# EAGLE schematic DeadHorsePCB (EAGLE 8.3.1)
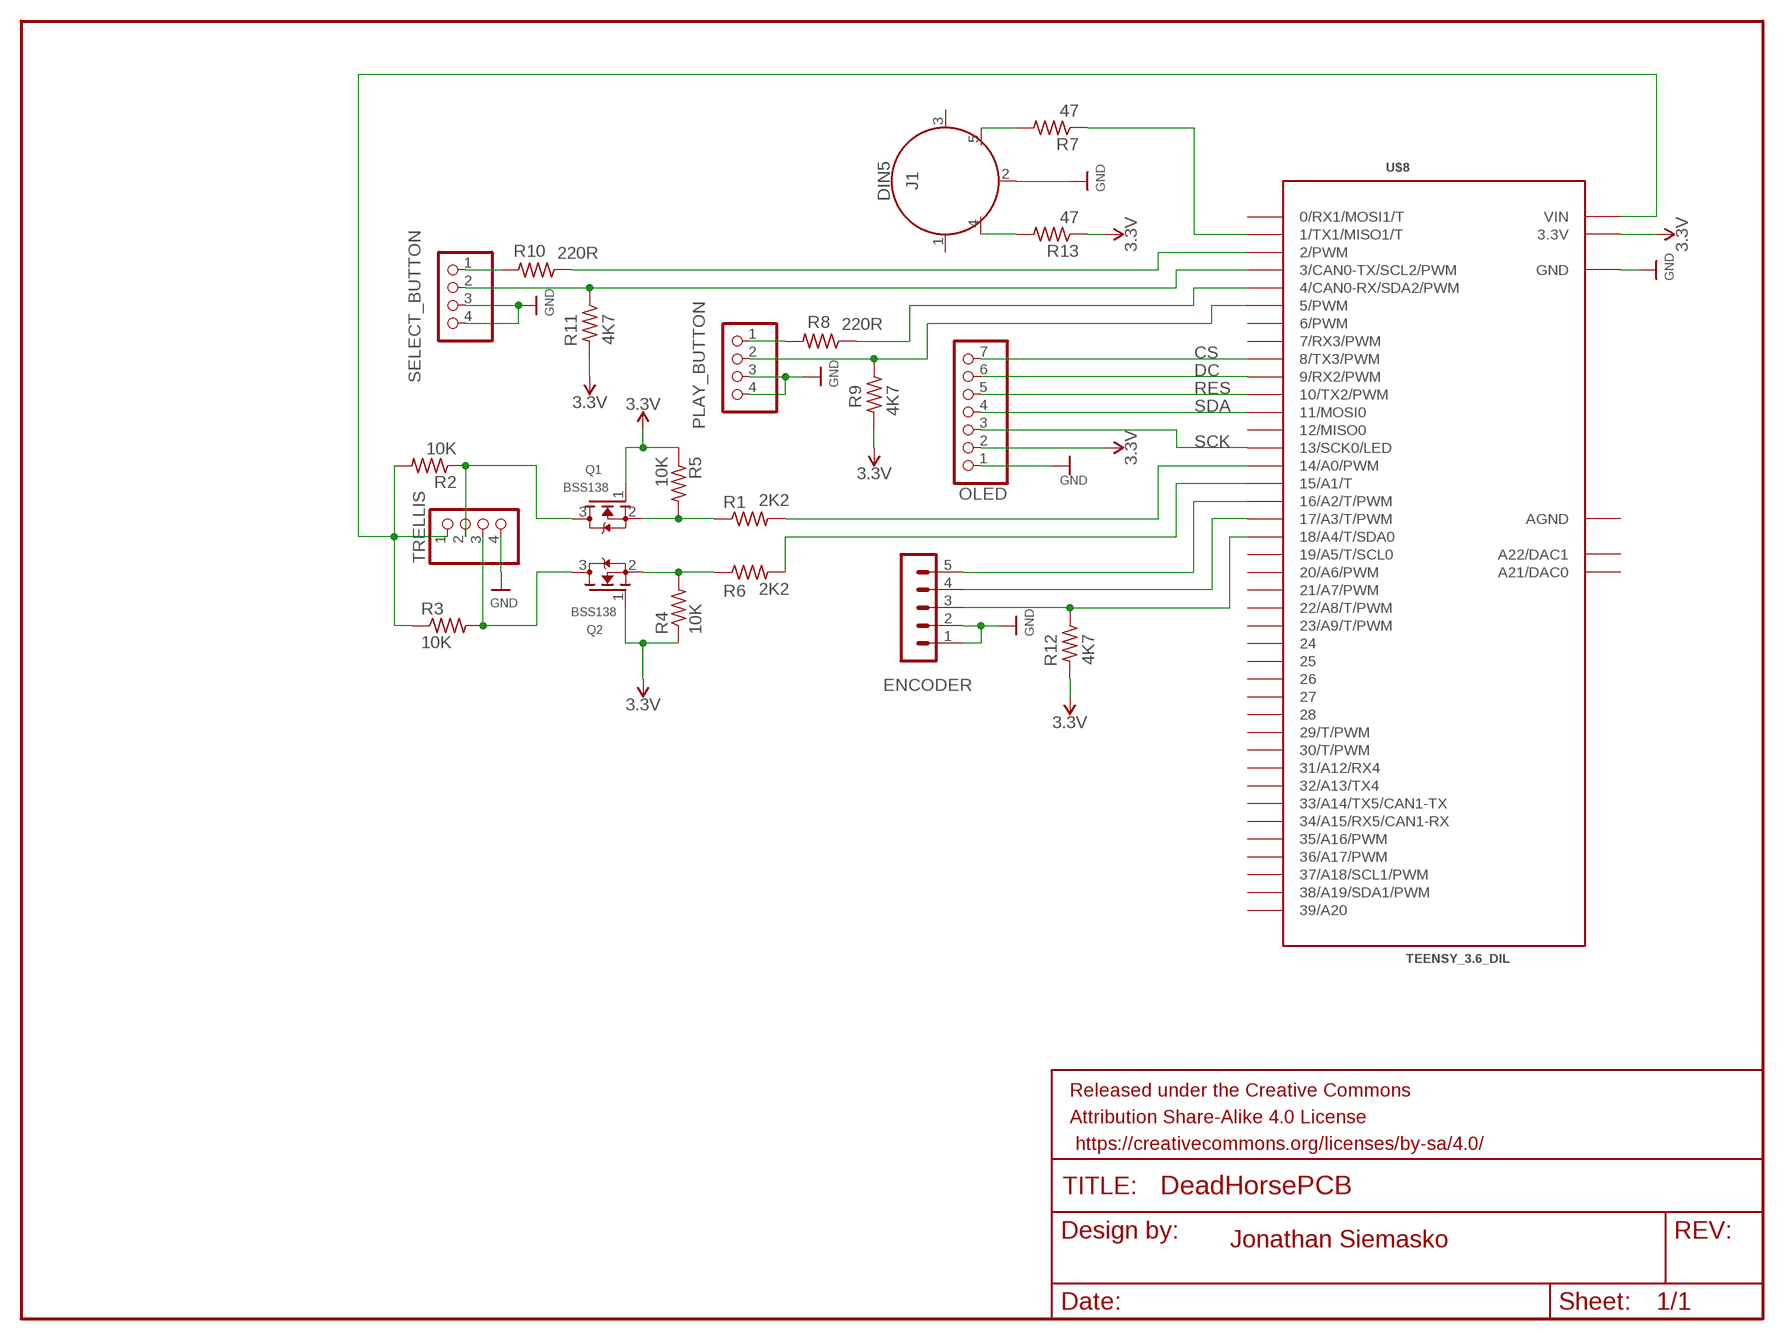
[diagram p0: schematic, sheet 1]

## Parts
ENCODER  MA05-1  [MA05-1]
FRAME1  FRAME-LETTER  [CREATIVE_COMMONS]
J1  DIN5  [DIN5-RA-PTH]
OLED  OLED  PINHD-1X7  [1X07]
PLAY_BUTTON  PlayBtn  PINHD-1X4  [1X04]
Q1  BSS138  MOSFET-NREFLOW  [SOT23]
Q2  BSS138  MOSFET-NREFLOW  [SOT23]
R1  2K2  R-US_R0805  [R0805]
R2  10K  R-US_R0805  [R0805]
R3  10K  R-US_R0805  [R0805]
R4  10K  R-US_R0805  [R0805]
R5  10K  R-US_R0805  [R0805]
R6  2K2  R-US_R0805  [R0805]
R7  47  R-US_R0805  [R0805]
R8  220R  R-US_R0805  [R0805]
R9  4K7  R-US_R0805  [R0805]
R10  220R  R-US_R0805  [R0805]
R11  4K7  R-US_R0805  [R0805]
R12  4K7  R-US_R0805  [R0805]
R13  47  R-US_R0805  [R0805]
SELECT_BUTTON  SelectBtn  PINHD-1X4  [1X04]
TRELLIS  TRELLIS  PINHD-1X4  [1X04]
U$8  TEENSY_3.6_DIL  [TEENSY_3.6_DIL]

## Nets
3.3V: OLED.2 Q1.1(G) Q2.1(G) R4.1 R5.1 R9.2 R11.2 R12.2 R13.1 U$8.3.3V U$8.3.3V3(3.3V)
CS: OLED.7 U$8.8(8/TX3/PWM)
DC: OLED.6 U$8.9(9/RX2/PWM)
GND [supply]: ENCODER.1 ENCODER.2 J1.2 OLED.1 PLAY_BUTTON.3 PLAY_BUTTON.4 SELECT_BUTTON.3 SELECT_BUTTON.4 TRELLIS.4 U$8.GND U$8.GND1(GND)
N$1: PLAY_BUTTON.1 R8.2
N$2: Q1.3(D) R2.1 TRELLIS.2
N$3: J1.4 R13.2
N$4: J1.5 R7.2
N$5: Q1.2(S) R1.1 R5.2
N$6: R1.2 U$8.14/A0(14/A0/PWM)
N$7: R6.2 U$8.15/A1(15/A1/T)
N$8: Q2.3(D) R3.2 TRELLIS.3
N$9: ENCODER.4 U$8.17/A3(17/A3/T/PWM)
N$10: ENCODER.5 U$8.16/A2(16/A2/T/PWM)
N$12: Q2.2(S) R4.2 R6.1
N$13: R8.1 U$8.4(4/CAN0-RX/SDA2/PWM)
N$14: PLAY_BUTTON.2 R9.1 U$8.5(5/PWM)
N$16: R10.1 U$8.2(2/PWM)
N$18: R10.2 SELECT_BUTTON.1
N$20: ENCODER.3 R12.1 U$8.18/A4(18/A4/T/SDA0)
N$21: R7.1 U$8.1(1/TX1/MISO1/T)
N$22: R11.1 SELECT_BUTTON.2 U$8.3(3/CAN0-TX/SCL2/PWM)
RES: OLED.5 U$8.10(10/TX2/PWM)
SCK: OLED.3 U$8.13(13/SCK0/LED)
SDA: OLED.4 U$8.11(11/MOSI0)
VIN [5v supply]: R2.2 R3.1 TRELLIS.1 U$8.VIN
Unconnected: J1.1 J1.3 U$8.0(0/RX1/MOSI1/T) U$8.6(6/PWM) U$8.7(7/RX3/PWM) U$8.12(12/MISO0) U$8.19/A5(19/A5/T/SCL0) U$8.20/A6(20/A6/PWM) U$8.21/A7(21/A7/PWM) U$8.22/A8(22/A8/T/PWM) U$8.23/A9(23/A9/T/PWM) U$8.24 U$8.25 U$8.26 U$8.27 U$8.28 U$8.29(29/T/PWM) U$8.30(30/T/PWM) U$8.31/A12(31/A12/RX4) U$8.32/A13(32/A13/TX4) U$8.33/A14(33/A14/TX5/CAN1-TX) U$8.34/A15(34/A15/RX5/CAN1-RX) U$8.35/A16(35/A16/PWM) U$8.36/A17(36/A17/PWM) U$8.37/A18(37/A18/SCL1/PWM) U$8.38/A19(38/A19/SDA1/PWM) U$8.39/A20 U$8.A21(A21/DAC0) U$8.A22(A22/DAC1)

## Notes on the sheet
- Jonathan Siemasko

## Power pins joined to a net without a drawn wire
AGND: U$8.AGND

## Library data of the parts
ENCODER = con-lstb:MA05-1: PIN HEADER; OC_FARNELL: unknown; OC_NEWARK: unknown
FRAME1 = SparkFun-Aesthetics:FRAME-LETTER: Schematic Frame - Letter Standard 8.5x11 US Letter frame
J1 = SparkFun-Connectors:DIN5: DIN5 Connector - Female Right Angle (frequently used as a MIDI Jack connector) This type of connector and cable is frequently used for transmitting midi data (musical instrument digital interface). It is what you usually see on a keyboard or set of electronic drums. Learn more here <https://en.wikipedia.org/wiki/MIDI>. For more information on the pinout and electrical specifications of MIDI communications, please see the following resource: https://www.midi.org/specifications/item/midi-din-electrical-specification Here is the connector we sell at SparkFun: MIDI Connector - Female Right Angle <https://www.sparkfun.com/products/9536> (PRT-09536) Datasheet <hhttp://www.sparkfun.com/datasheets/Prototyping/Connectors/MIDI-RA.pdf> It is used on this SparkFun product: SparkFun MIDI Shield <https://www.sparkfun.com/products/12898> (DEV-12898); PROD_ID: CONN-09481
OLED = pinhead:PINHD-1X7: PIN HEADER
PLAY_BUTTON SELECT_BUTTON TRELLIS = pinhead:PINHD-1X4: PIN HEADER
Q1 Q2 = adafruit:MOSFET-N: N-Channel Mosfet 2N7002E - 60V 260mA SOT23 [Digikey: 2N7002ET1GOSTR-ND] - REEL BSH103 - 30V 850mA SOT23 [Digikey: 568-5013-1-ND]
R1-R13 = adafruit:R-US_: RESISTOR, American symbol
U$8 = Teensy_3_and_LC_Series_Boards_v1.4:TEENSY_3.6_DIL: Teensy 3.6 DIL Package